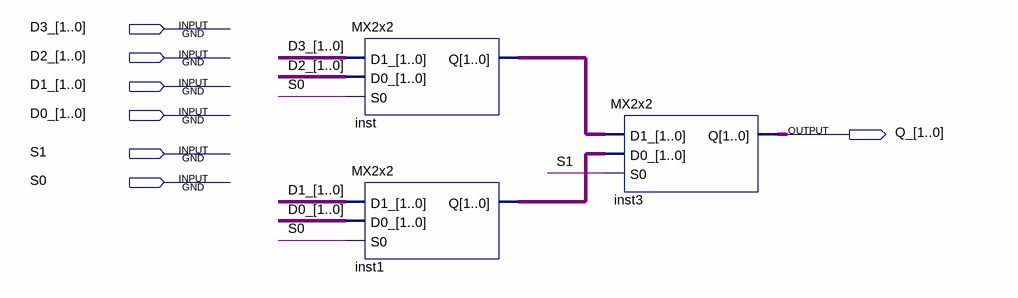
[diagram p0: schematic sheet]
// Quartus schematic MX4x2.bdf as structural Verilog: 3 symbols, 7 pins
module MX4x2 (
  input  [1:0] D3_,
  input  [1:0] D2_,
  input  [1:0] D1_,
  input  [1:0] D0_,
  input  S1,
  input  S0,
  output [1:0] Q_
);

  wire [1:0] inst1_q, inst_q;

  MX2x2 inst (.D1_(D3_), .D0_(D2_), .S0(S0), .Q(inst_q));
  MX2x2 inst1 (.D1_(D1_), .D0_(D0_), .S0(S0), .Q(inst1_q));
  MX2x2 inst3 (.D1_(inst_q), .D0_(inst1_q), .S0(S1), .Q(Q_));
endmodule
